# EAGLE design domus-silicea - N1 - nRF24L01 (EAGLE 7.3.0)
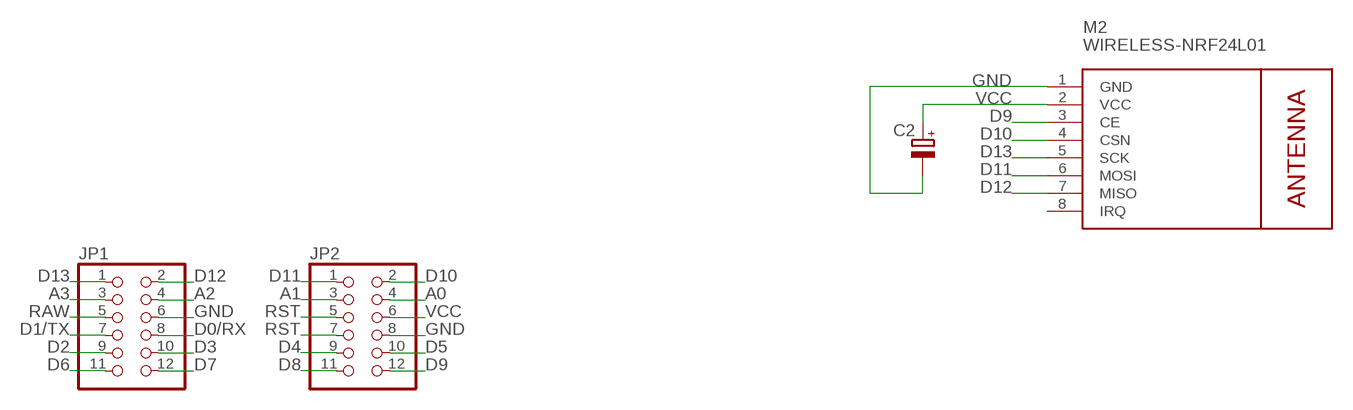
[diagram p0: schematic, sheet 1]

## Parts
C2  CPOL-EUE2,5-6E  [E2,5-6E]
JP1  PINHD-2X6  [2X06]
JP2  PINHD-2X6  [2X06]
M2  WIRELESS-NRF24L01  [WIRELESS-NRF24L01]

## Nets
A0: JP2.4
A1: JP2.3
A2: JP1.4
A3: JP1.3
D0/RX: JP1.8
D1/TX: JP1.7
D2: JP1.9
D3: JP1.10
D4: JP2.9
D5: JP2.10
D6: JP1.11
D7: JP1.12
D8: JP2.11
D9: JP2.12 M2.3(CE)
D10: JP2.2 M2.4(CSN)
D11: JP2.1 M2.6(MOSI)
D12: JP1.2 M2.7(MISO)
D13: JP1.1 M2.5(SCK)
GND: C2.- JP1.6 JP2.8 M2.1(GND)
RAW: JP1.5
RST: JP2.5 JP2.7
VCC: C2.+ JP2.6 M2.2(VCC)
Unconnected: M2.8(IRQ)

## Library data of the parts
C2 = rcl:CPOL-EU: POLARIZED CAPACITOR, European symbol
JP1 JP2 = pinhead:PINHD-2X6: PIN HEADER
M2 = diy-modules:WIRELESS-NRF24L01: 2.4 GHz Wireless Module based on NRF24L01 chip

## Board
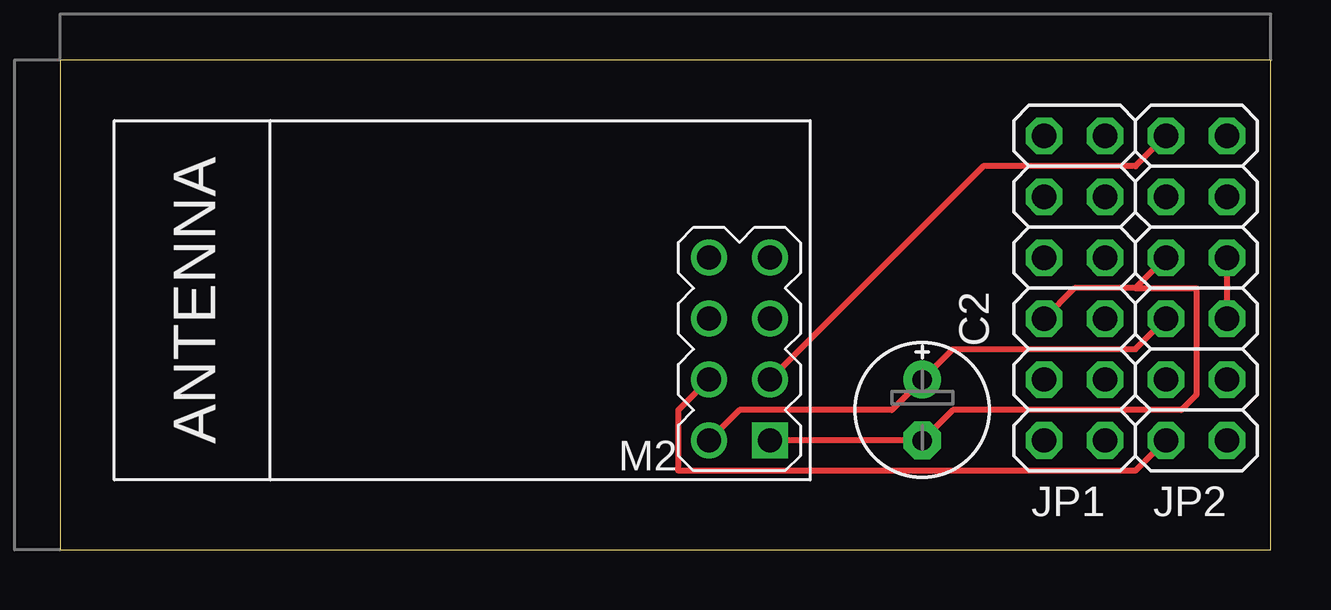
[diagram p1: board, top side]
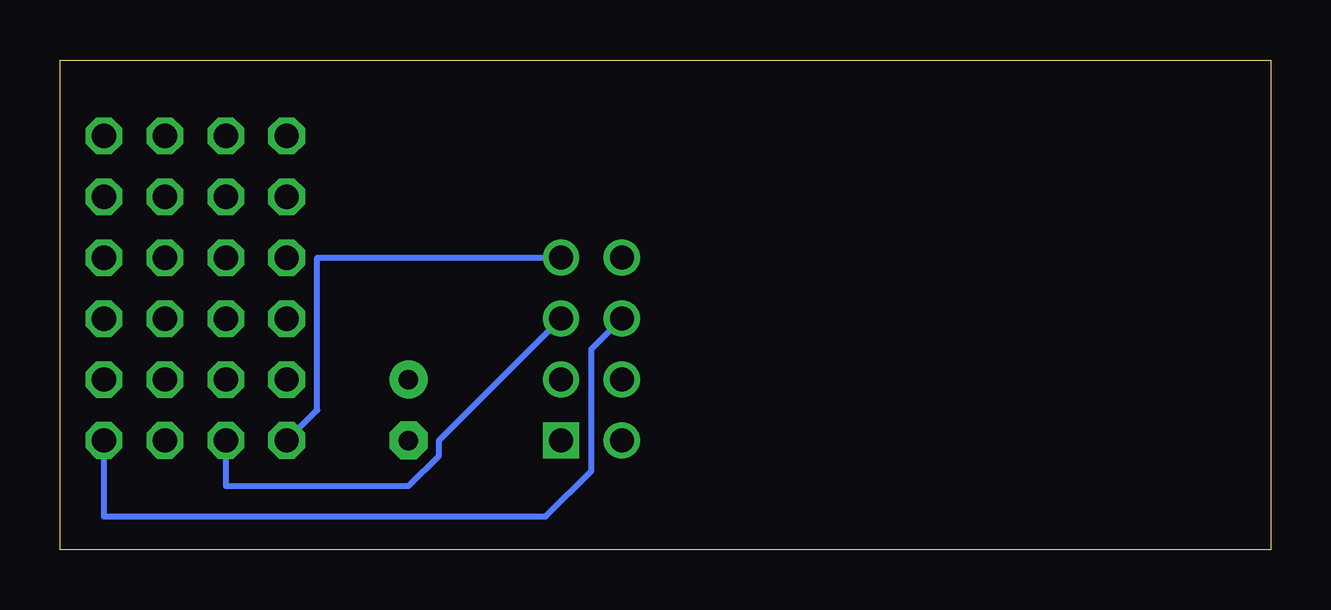
[diagram p2: board, bottom side, seen from below]

Size 50.47 x 20.44 mm. Coordinates in mm from the lower left corner, seen from the top.
Outline: 0,0 50.47,0 50.47,20.44 0,20.44 0,0
Copper layers (1*16): Top 0.035mm / dielectric 1.5mm / Bottom 0.035mm
Design rules "default": minimum track width 10mil, minimum drill 24mil, track to track 8mil, track to pad 8mil, pad to pad 8mil, via to via 8mil, smd to smd 8mil, copper to edge 40mil, drill to drill 8mil, minimum pad ring 10mil, minimum via ring 8mil, stop-mask expansion 4mil, vias tented up to drill 0mil, thermal gap 10mil

### Footprints (pad centres in the part's own frame; a part is rotated, then mirrored left to right if it is on the bottom)
E2,5-6E = drill 0.813 pad 1.575: + -1.27,0 | drill 0.813 pad 1.575 octagon: - 1.27,0
2X06 = drill 1.016 octagon: 1 -6.35,-1.27; 2 -6.35,1.27; 3 -3.81,-1.27; 4 -3.81,1.27; 5 -1.27,-1.27; 6 -1.27,1.27; 7 1.27,-1.27; 8 1.27,1.27; 9 3.81,-1.27; 10 3.81,1.27; 11 6.35,-1.27; 12 6.35,1.27
WIRELESS-NRF24L01 = drill 1 square: 1 -12.7,6.35 | drill 1: 2 -10.16,6.35; 3 -12.7,3.81; 4 -10.16,3.81; 5 -12.7,1.27; 6 -10.16,1.27; 7 -12.7,-1.27; 8 -10.16,-1.27

### Placement (x,y rotation side)
C2  35.94,5.84 270 top
JP1  42.29,10.92 90 top
JP2  47.37,10.92 90 top
M2  16.89,10.92 180 top

### Tracks (layer width: path | path; a pad name or v marks a point on that pad's centre or on a via)
D9
  Top 0.254: M2.3 38.48,16 44.83,16 JP2.12
D10
  Top 0.254: M2.4 25.78,5.84 25.78,3.3 44.83,3.3 JP2.2
D11
  Bottom 0.254: M2.6 28.32,8.38 28.32,3.3 30.23,1.4 48.64,1.4 JP2.1
D12
  Bottom 0.254: M2.7 39.75,12.19 39.75,5.84 JP1.2
D13
  Bottom 0.254: M2.5 34.67,4.57 34.67,3.94 35.94,2.67 43.56,2.67 JP1.1
GND
  Top 0.254: M2.1 C2.- 37.21,5.84 46.74,5.84 47.37,6.48 47.37,10.92 44.83,10.92 | JP1.6 42.29,10.92 44.83,10.92 | JP2.8 44.83,10.92
RST
  Top 0.254: JP2.7 JP2.5
VCC
  Top 0.254: M2.2 28.32,5.84 34.67,5.84 C2.+ 37.21,8.38 44.83,8.38 JP2.6